# EAGLE design Smart_Plant_patch (EAGLE 9.5.1)
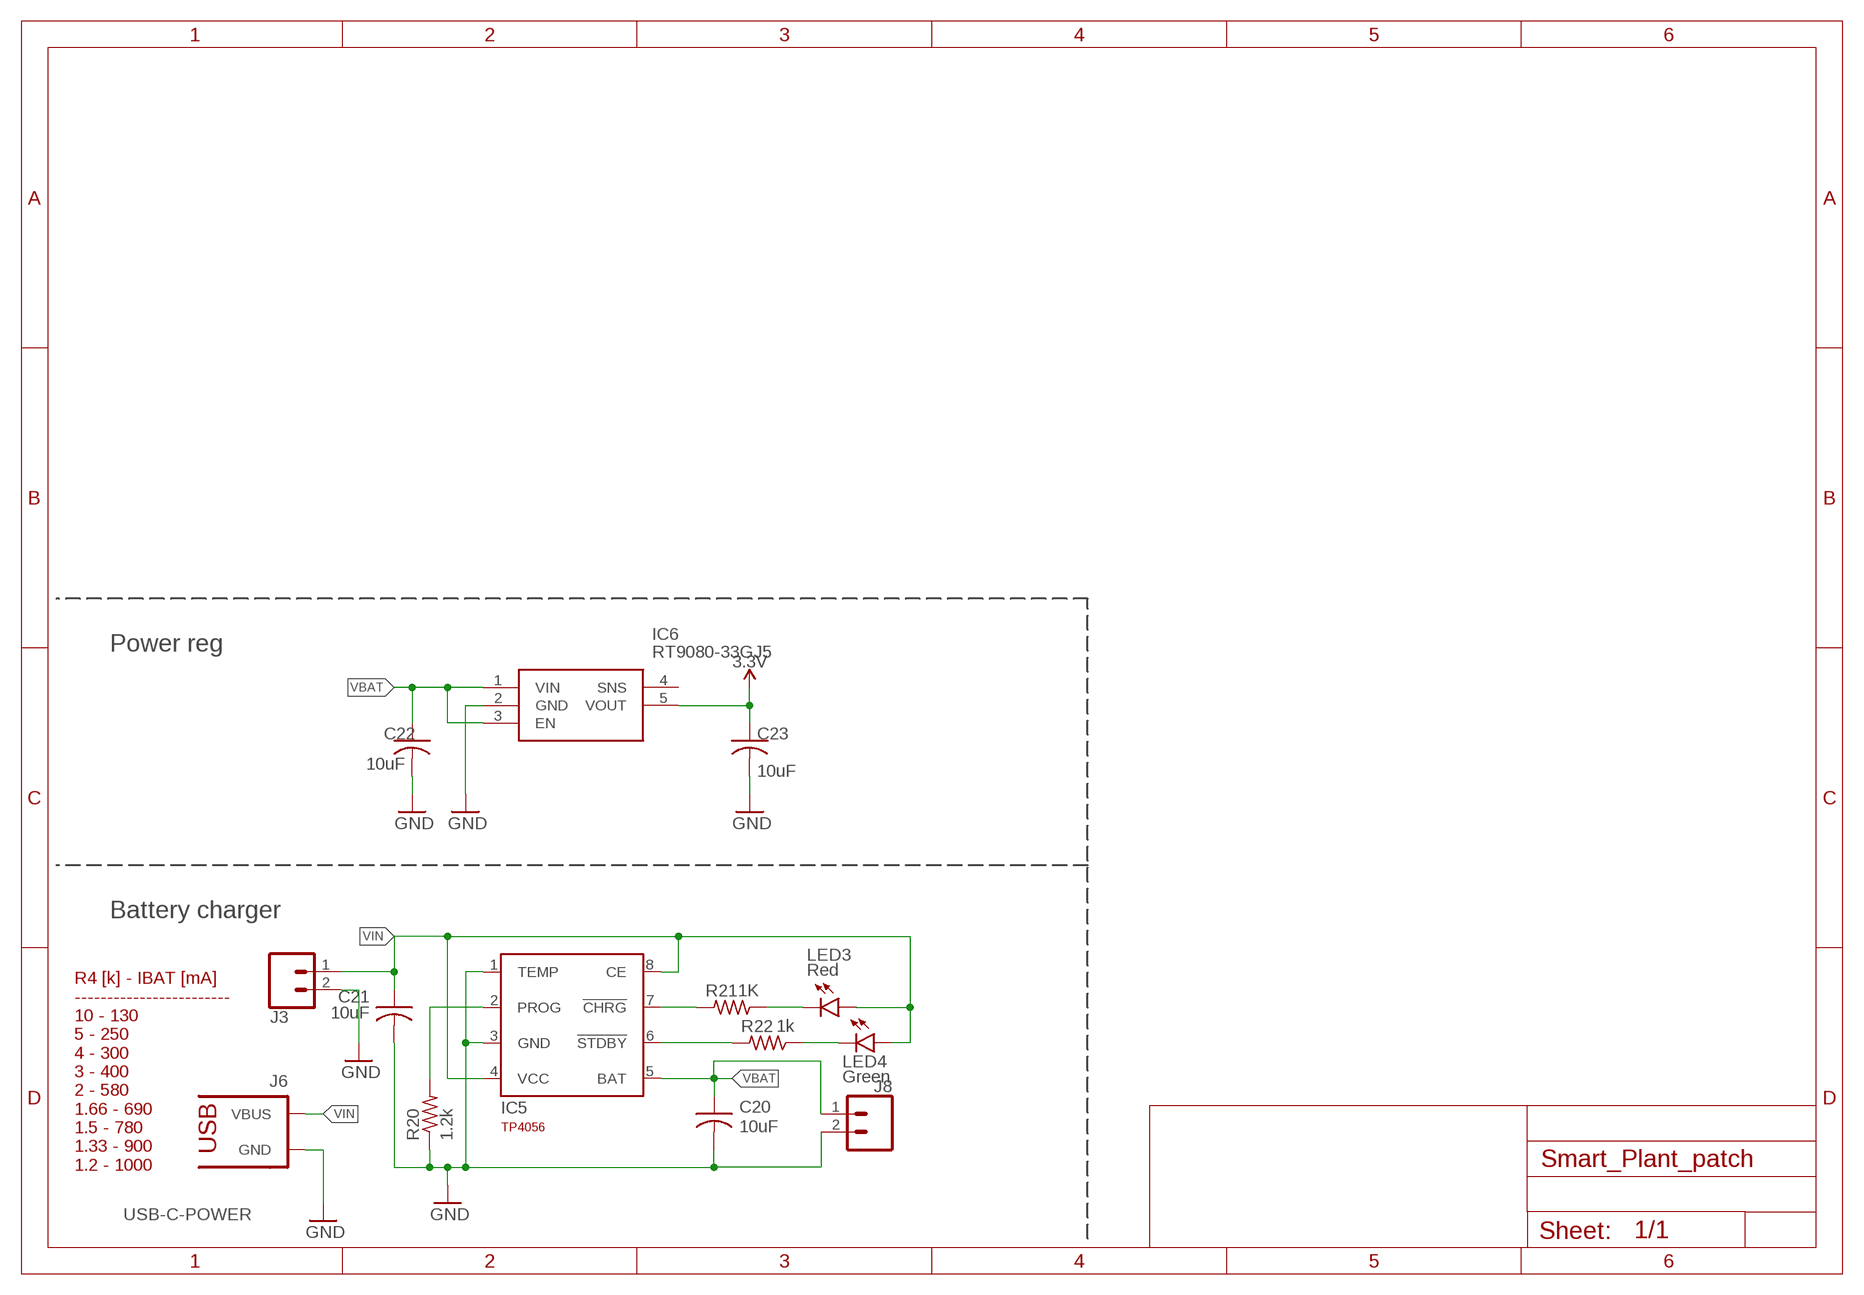
[diagram p0: schematic, sheet 1]

## Parts
C20  10uF  C-USC0603  [C0603]
C21  10uF  C-USC0603  [C0603]
C22  10uF  C-USC0603  [C0603]
C23  10uF  C-USC0603  [C0603]
IC5  TP4056  [SOT23-8]
IC6  RT9080-33GJ5  [SOT94P280X100-5N]
J3  CONN_02  [1X02]
J6  USB-C-POWER  [USB-C-POWER]
J8  CONN_02-JST-2MM-SMT  [JST-2-SMD]
LED3  Red  LED0603  [LED_0603]
LED4  Green  LED0603  [LED_0603]
R20  1.2k  R-US_R0603  [R0603]
R21  1K  R-US_R0603  [R0603]
R22  1k  R-US_R0603  [R0603]

## Nets
3.3V: C23.1 IC6.5(VOUT)
GND: C20.2 C21.2 C22.2 C23.2 IC5.1(TEMP) IC5.3(GND) IC6.2(GND) J3.2 J6.GND J8.2 R20.1
N$35: IC5.6(!STDBY) R22.2
N$46: LED3.C R21.1
N$47: LED4.C R22.1
N$48: IC5.2(PROG) R20.2
N$49: IC5.7(!CHRG) R21.2
VBAT: C20.1 C22.1 IC5.5(BAT) IC6.1(VIN) IC6.3(EN) J8.1
VIN: C21.1 IC5.4(VCC) IC5.8(CE) J3.1 J6.VBUS LED3.A LED4.A
Unconnected: IC6.4(SNS)

## Notes on the sheet
- Power reg
- Battery charger
- R4 [k] - IBAT [mA]
  ------------------------
  10 - 130
  5 - 250
  4 - 300
  3 - 400
  2 - 580
  1.66 - 690
  1.5 - 780
  1.33 - 900
  1.2 - 1000

## Library data of the parts
C20-C23 = rcl:C-US: CAPACITOR, American symbol; SPICEPREFIX: C
IC5 = TP4056:TP4056: TP4056 Data sheet <http://goo.gl/J7k8TF> Dave.Calaway Eagle Library <https://goo.gl/Muy1Tr>
IC6 = SamacSys_Parts:RT9080-33GJ5: IC REG LIN 3.3V 600MA TSOT23-5 Source: Datasheet <https://www.richtek.com/assets/product_file/RT9080/DS9080-05.pdf>; DESCRIPTION: IC REG LIN 3.3V 600MA TSOT23-5; HEIGHT: 1mm; LCSC: C841192; MANUFACTURER_NAME: RICHTEK; MANUFACTURER_PART_NUMBER: RT9080-33GJ5
J3 = SparkFun-Connectors:CONN_02: Multi connection point. Often used as Generic Header-pin footprint for 0.1 inch spaced/style header connections On any of the 0.1 inch spaced packages, you can populate with these: Break Away Headers - Straight <https://www.sparkfun.com/products/116> (PRT-00116) Break Away Male Headers - Right Angle <https://www.sparkfun.com/products/553> (PRT-00553) Female Headers <https://www.sparkfun.com/products/115> (PRT-00115) Break Away Headers - Machine Pin <https://www.sparkfun.com/products/117> (PRT-00117) Break Away Female Headers - Swiss Machine Pin <https://www.sparkfun.com/products/743> (PRT-00743) For SCREWTERMINALS and SPRING TERMINALS visit here: Screw Terimnals on SparkFun.com <https://www.sparkfun.com/search/results?term=Screw+Terminals> (5mm/3.5mm/2.54mm spacing) This device is also useful as a general connection point to wire up your design to another part of your project. Our various solder wires solder well into these plated through hole pads. Hook-Up Wire - Assortment (Stranded, 22 AWG) <https://www.sparkfun.com/products/11375> (PRT-11375) Hook-Up Wire - Assortment (Solid Core, 22 AWG) <https://www.sparkfun.com/products/11367> (PRT-11367) View the entire wire category on our website here <https://www.sparkfun.com/categories/141> Special notes: Molex polarized connector foot print use with: PRT-08233 with associated crimp pins and housings. 2.54_SCREWTERM for use with PRT-10571. 3.5mm Screw Terminal footprints for PRT-08084 5mm Screw Terminal footprints for use with PRT-08432
J6 = SpaceDIY_connectors:USB-C-POWER: AliExpress Special! Connect 5.1k 10% resistors to each CC pin, pulled up to 3.3v or 5.0v.
J8 = SpaceDIY_connectors:CONN_02: Multi connection point. Often used as Generic Header-pin footprint for 0.1 inch spaced/style header connections On any of the 0.1 inch spaced packages, you can populate with these: Break Away Headers - Straight <https://www.sparkfun.com/products/116> (PRT-00116) Break Away Male Headers - Right Angle <https://www.sparkfun.com/products/553> (PRT-00553) Female Headers <https://www.sparkfun.com/products/115> (PRT-00115) Break Away Headers - Machine Pin <https://www.sparkfun.com/products/117> (PRT-00117) Break Away Female Headers - Swiss Machine Pin <https://www.sparkfun.com/products/743> (PRT-00743) For SCREWTERMINALS and SPRING TERMINALS visit here: Screw Terimnals on SparkFun.com <https://www.sparkfun.com/search/results?term=Screw+Terminals> (5mm/3.5mm/2.54mm spacing) This device is also useful as a general connection point to wire up your design to another part of your project. Our various solder wires solder well into these plated through hole pads. Hook-Up Wire - Assortment (Stranded, 22 AWG) <https://www.sparkfun.com/products/11375> (PRT-11375) Hook-Up Wire - Assortment (Solid Core, 22 AWG) <https://www.sparkfun.com/products/11367> (PRT-11367) View the entire wire category on our website here <https://www.sparkfun.com/categories/141> Special notes: Molex polarized connector foot print use with: PRT-08233 with associated crimp pins and housings. 2.54_SCREWTERM for use with PRT-10571. 3.5mm Screw Terminal footprints for PRT-08084 5mm Screw Terminal footprints for use with PRT-08432; LCSC: C3029440; PROD_ID: CONN-11443
LED3 LED4 = SpaceDIY_semiconductors:LED: LED (Generic) Standard schematic elements and footprints for 5mm, 3mm, 0402, 0603 , 0805 and 1206 sized LEDs. Generic LEDs with no color specified.
R20-R22 = rcl:R-US_: RESISTOR, American symbol; SPICEPREFIX: R

## Board
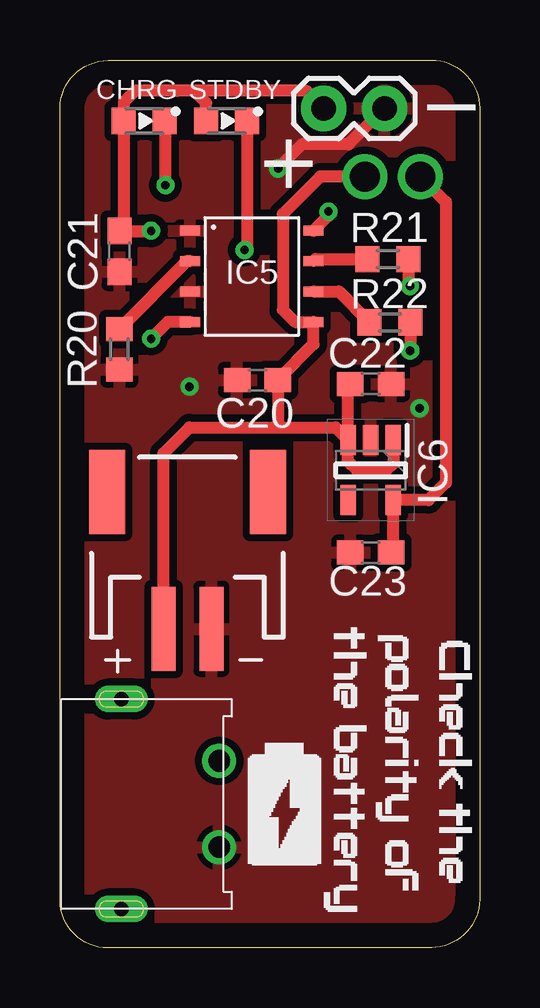
[diagram p1: board, top side]
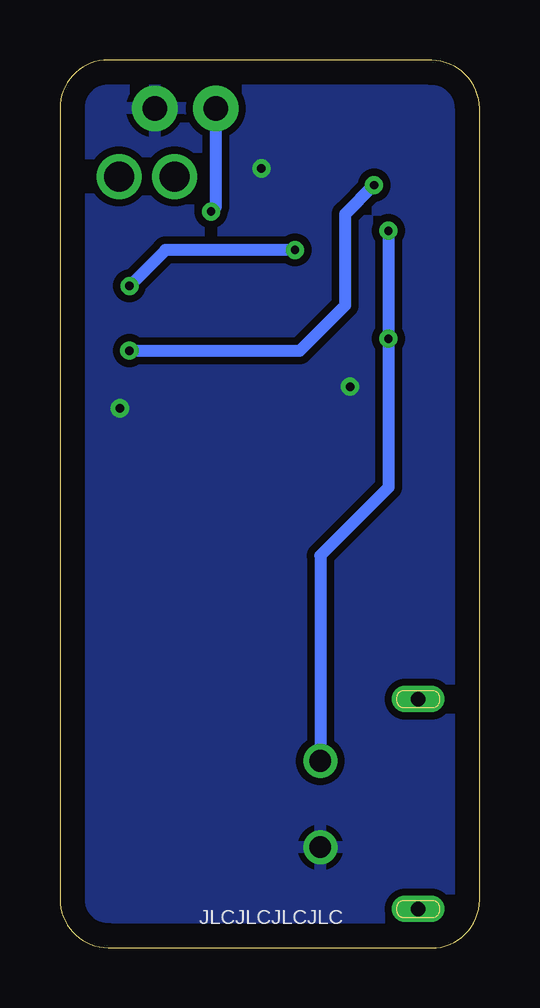
[diagram p2: board, bottom side, seen from below]

Size 17.5 x 37.02 mm. Coordinates in mm from the lower left corner, seen from the top.
Outline: 15.5,37.02 arc-90 17.5,35.02 17.5,2.02 arc-90 15.5,0.02 2,0 arc-90 0,2 0,35 arc-90 2,37 15.5,37.02
Copper layers (1*16): Top 0.035mm / dielectric 1.5mm / Bottom 0.035mm
Design rules "default": minimum track width 6mil, minimum drill 0.35mm, track to track 6mil, track to pad 6mil, pad to pad 6mil, via to via 6mil, smd to smd 6mil, copper to edge 40mil, drill to drill 6mil, minimum pad ring 10mil, minimum via ring 8mil, stop-mask expansion 4mil, vias tented up to drill 0mil, thermal gap 10mil

### Footprints (pad centres in the part's own frame; a part is rotated, then mirrored left to right if it is on the bottom)
C0603 = smd 1.1 x 1: 1 -0.85,0; 2 0.85,0
SOT23-8 = smd 0.42 x 0.835: 1 -1.905,-2.58; 2 -0.635,-2.58; 3 0.635,-2.58; 4 1.905,-2.58; 5 1.905,2.58; 6 0.635,2.58; 7 -0.635,2.58; 8 -1.905,2.58
SOT94P280X100-5N = smd 1.25 x 0.65: 1 -1.25,0.94; 2 -1.25,0; 3 -1.25,-0.94; 4 1.25,-0.94; 5 1.25,0.94
1X02 = drill 1.016 pad 1.88: 1 0,0; 2 2.54,0
USB-C-POWER = drill 0.9: GND 1.8,4.08; VBUS -1.8,4.08 | drill 0.6 long: SHIELD1 -4.375,0; SHIELD4 4.375,0
JST-2-SMD = smd 1 x 3.5: 1 1,3.95; 2 -1,3.95 | smd 1.5 x 3.5: NC1 3.35,-1.75; NC2 -3.35,-1.75
LED_0603 = smd 1 x 1.1: A -0.86,0; C 0.84,0
R0603 = smd 1 x 1.1: 1 -0.85,0; 2 0.85,0

### Placement (x,y rotation side)
C20  8.24,23.68 180 top
C21  2.48,29.04 270 top
C22  12.96,23.52 0 top
C23  12.96,16.48 180 top
IC5  8,28 270 top
IC6  12.96,19.92 270 top
J3  11,35 0 top
J6  2.56,6 270 top
J8  5.32,17.26 180 top
LED3  6.96,34.48 0 top
LED4  3.52,34.48 0 top
R20  2.48,24.96 90 top
R21  13.68,28.72 180 top
R22  13.76,26.08 180 top

### Tracks (layer width: path | path; a pad name or v marks a point on that pad's centre or on a via)
3.3V  (via drill 1.25)
  Top 0.508: v15.04,32.16 16.1,31.1 16.1,19.4 15.37,18.67 IC6.5 13.9,16.57 C23.1
GND  (via drill 0.35)
  Top 0.508: J3.2 12.04,33.5 10.1,33.5 v9.1,32.5
  other vias: 15,22.5 5.4,23.4
  pour Top (isolate 0.305): 1.98,0.02 arc-90 0,2 0,35 arc-90 2.02,37.02 15.5,37.02 arc-90 17.5,35.02 17.51,7.88 17.5,2.02 arc-90 15.5,0.02
  pour Bottom (isolate 0.305): 1.98,0.02 arc-90 0,2 0,35 arc-90 2.02,37.02 15.5,37.02 arc-90 17.5,35.02 17.5,2.02 arc-90 15.5,0.02
N$35
  Top 0.508: IC5.6 11.62,27.36 R22.2
N$46  (via drill 0.35)
  Top 0.508: LED3.C 7.8,29.2 v7.7,29.1 | v14.6,27.6 14.53,27.67 R21.1
  Bottom 0.508: v7.7,29.1 13.1,29.1 v14.6,27.6
N$47  (via drill 0.35)
  Top 0.508: R22.1 v14.61,24.9 | v4.4,31.8 4.4,34.44 LED4.C
  Bottom 0.508: v14.61,24.9 7.5,24.9 5.6,26.8 5.6,30.6 v4.4,31.8
N$48
  Top 0.508: R20.2 5.3,28.64 IC5.2
N$49
  Top 0.508: IC5.7 10.66,28.72 R21.2
VBAT  (via drill 1.25)
  Top 0.508: J8.1 4.32,20.62 5.4,21.7 9.1,21.7 | 9.1,21.7 11.49,21.7 IC6.3 | IC6.3 12.02,23.43 C22.1 | 9.1,21.7 C20.1 10.58,25.17 IC5.5 9.8,26.09 9.3,26.6 9.3,30.6 10.86,32.16 v12.72,32.16 | IC6.1 13.9,20.2 13.6,19.9 12.4,19.9 12.02,20.28 IC6.3
VIN  (via drill 0.35)
  Top 0.508: IC5.8 11.2,30.52 v11.2,30.7 | v3.8,29.9 v3.79,29.89 C21.1 2.66,30.07 LED4.A 2.66,35.26 3.13,35.73 4.9,35.73 | IC5.4 4.5,26.09 v3.8,25.4 | LED3.A 6.1,35.23 5.6,35.73 | 5.6,35.73 | 5.6,35.73 4.9,35.73 | J3.1 10.27,35.73 4.9,35.73
  Bottom 0.508: v11.2,30.7 11,30.9 J3.1 | v3.8,29.9 v3.8,25.4 3.8,19.2 6.64,16.36 J6.VBUS

### Text on the board
tNames: CHRG | STDBY
bNames: JLCJLCJLCJLC